# Altium project DATN_Ver1.0.PrjPcb
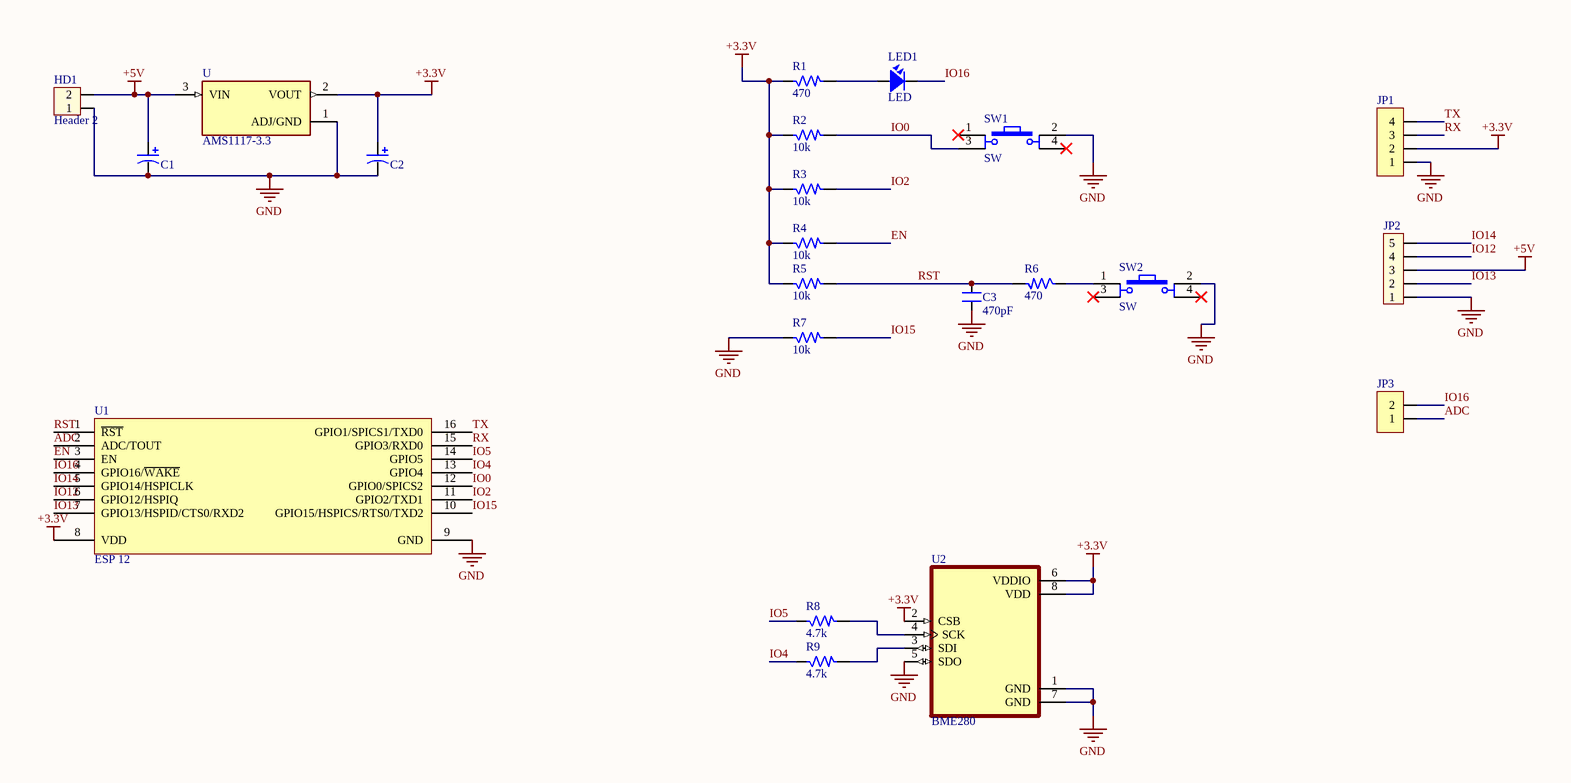
[diagram p0: DATN.SchDoc]
1 sheet, 22 parts. Net scope: global (net labels, ports and power ports of the same name join across sheets).
Board file: DATN.PcbDoc

## Sheet DATN.SchDoc
size B

### Parts
C1  CAP_TAN_SMD  [CAP_7343]  (value not drawn)
C2  CAP_TAN_SMD  [CAP_7343]  (value not drawn)
C3  470pF  [CAP_0805]
HD1  Header 2  [HED2]
JP1  JP4  [JP4-D1C]  (value not drawn)
JP2  JP5_2  [JP5H]  (value not drawn)
JP3  JP2  [JP2-D1T]  (value not drawn)
LED1  LED  [LED-3]
R1  470  [RES-SMD-0805]
R2  10k  [RES-SMD-0805]
R3  10k  [RES-SMD-0805]
R4  10k  [RES-SMD-0805]
R5  10k  [RES-SMD-0805]
R6  470  [RES-SMD-0805]
R7  10k  [RES-SMD-0805]
R8  4.7k  [RES-SMD-0805]
R9  4.7k  [RES-SMD-0805]
SW1  SW  [SW4]
SW2  SW  [SW4]
U  AMS1117-3.3  [SOT229P700X180-4N]
U1  ESP 12  [ESP12_small]
U2  BME280  [PSON65P250X250X100-8N]

### Nets
+3.3V: C2.1 JP1.2 R1.1 R2.1 R3.1 R4.1 R5.1 U.2(VOUT) U1.8(VDD) U2.2(CSB) U2.6(VDDIO) U2.8(VDD)
+5V: C1.1 HD1.2 JP2.3 U.3(VIN)
GND: C1.2 C2.2 C3.1 HD1.1 JP1.1 JP2.1 R7.1 SW1.2 SW2.2 U.1(ADJ/GND) U1.9(GND) U2.1(GND) U2.5(SDO) U2.7(GND)
ADC: JP3.1 U1.2(ADC/TOUT)
EN: R4.2 U1.3(EN)
IO0: R2.2 SW1.3 U1.12(GPIO0/SPICS2)
IO2: R3.2 U1.11(GPIO2/TXD1)
IO4: R9.1 U1.13(GPIO4)
IO5: R8.1 U1.14(GPIO5)
IO12: JP2.4 U1.6(GPIO12/HSPIQ)
IO13: JP2.2 U1.7(GPIO13/HSPID/CTS0/RXD2)
IO14: JP2.5 U1.5(GPIO14/HSPICLK)
IO15: R7.2 U1.10(GPIO15/HSPICS/RTS0/TXD2)
IO16: JP3.2 LED1.2 U1.4(GPIO16/~{WAKE})
RST: C3.2 R5.2 R6.2 U1.1(~{RST})
RX: JP1.3 U1.15(GPIO3/RXD0)
TX: JP1.4 U1.16(GPIO1/SPICS1/TXD0)
NetLED1_1: LED1.1 R1.2
NetR6_1: R6.1 SW2.1
NetR8_2: R8.2 U2.4(SCK)
NetR9_2: R9.2 U2.3(SDI)

Not connected (* = marked no-connect by the designer): SW1 1* 4*; SW2 3* 4*

### Library data of the parts
C1 C2 = CAP_TAN_SMD: Polazied Tantalum Capacitor
C3 = CN1: Cap np  1pF - 472pF; Value: 100pF
HD1 = Hed2: Header 2 (Green); Value: Header 2
JP1 = JP4: WR-PHD 2.54 mm Angled Socket Header; Manufacturer: W¨¹rth Elektronik eiSos GmbH; partNo: 613004143121; ComponentLink1 Description: Manufacturer; ComponentLink2 Description: Datasheet; NoPins: 04; Created Date: 29 March 2013; ComponentLink1URL: http://www.we-online.com; ComponentLink2URL: http://katalog.we-online.de/em/datasheet/6130xx143121.pdf; Created by: Karrer Zheng
JP3 = JP2: WR-PHD 2.54 mm Angled Socket Header; Manufacturer: W¨¹rth Elektronik eiSos GmbH; partNo: 613002143121; ComponentLink1 Description: Manufacturer; ComponentLink2 Description: Datasheet; NoPins: 02; Created Date: 29 March 2013; ComponentLink1URL: http://www.we-online.com; ComponentLink2URL: http://katalog.we-online.de/em/datasheet/6130xx143121.pdf; Created by: Karrer Zheng
LED1 = LED: LED Single colour Green and Red; Value: LED 3 ly Single Colour
R1-R9 = R: Resistor 1/4W; Value: R1/4W - 1K
SW1 SW2 = SW4: Switch button 4 pin; Value: Button chip 4 pin
U = AMS1117-3.3: Sot223/Pkg 1-Amp 3.3-Volt Low Drop Out Voltage Regulatator; MF: Advanced Monolithic Systems; Price: None; Package: None; Value: *; MP: AMS1117-3.3; Availability: Unavailable; SnapEDA_Link: https://www.snapeda.com/parts/AMS1117-3.3/Advanced%20Monolithic%20Systems/view-part/53450/?ref=snap
U1 = ESP_12: ESP-12 Wi-Fi Module by AI-Thinker; IC: ESP8266-EX; Vendor: Ai-thinker
U2 = BME280: DIGITAL HUMIDITY, PRESSURE AND TEMPERATURE SENSOR<br>* Digital interface IÂ²C (up to 3.4 MHz) and SPI (3 and 4 wire, up to 10 MHz)* Supply voltage VDD main supply voltage range: 1.71 V to 3.6 V*VDDIO interface voltage range: 1.2 V to 3.6 V<br> Operating range -40â€¦+85 Â°C, 0â€¦100 % rel. humidity, 300â€¦1100 hPa <br><br>  The library has been designed by<a href="https://www.facebook.com/groups/eaglecadsoftUK"> Richard Magdycz</a>; Price: None; MP: BME280; Value: *; Availability: Unavailable; Package: None